# Altium schematic sheet BLE.SchDoc: BLE AC6925A
size A4; SheetNumber: 2; SheetTotal: 3; DOC_NO_SCH_DWG: #0112023010801
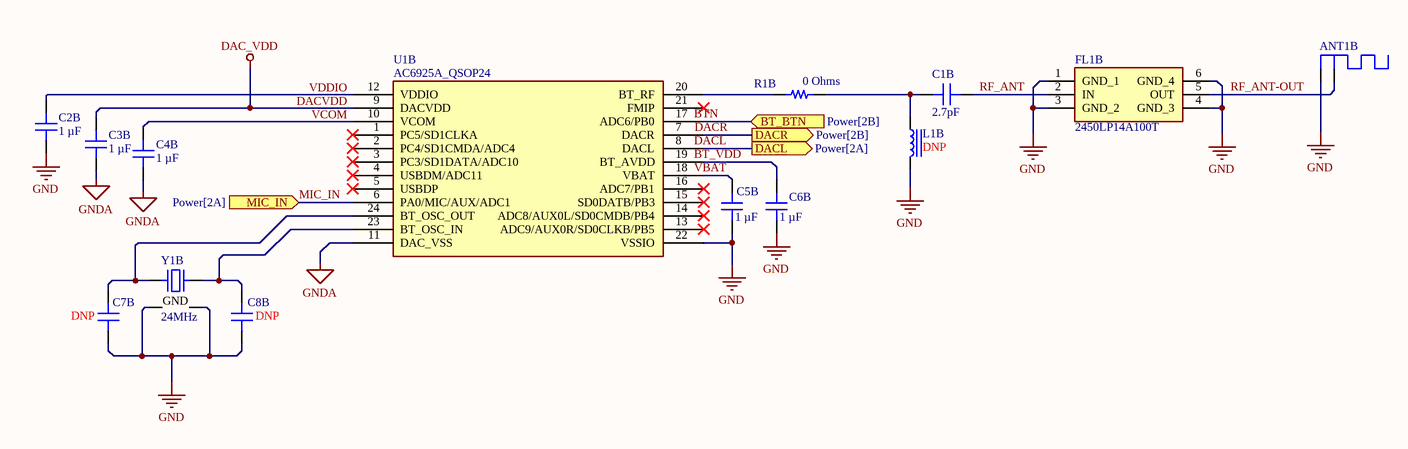
[diagram p0: BLE.SchDoc]

## Parts
ANT1B  ANTENNA  [RN-ANT]  (value not drawn)
C1B  2.7pF  [CAP 0402_1005]
C2B  1 µF  [CAP 0603_1608]
C3B  1 µF  [CAP 0603_1608]
C4B  1 µF  [CAP 0603_1608]
C5B  1 µF  [CAP 0603_1608]
C6B  1 µF  [CAP 0603_1608]
C7B  DNP  [CAP 0402_1005]
C8B  DNP  [CAP 0402_1005]
FL1B  2450LP14A100T  [2450LP14A100T]
L1B  DNP  [IND 0402_1005 RF WW]
R1B  0 Ohms  [RES 0402_1005]
U1B  AC6925A  [AC6925A]  (value not drawn)
Y1B  24MHz  [ABRACON ABM10]

## Ports
BT_BTN (in, see Power[2B]), DACL (out, see Power[2A]), DACR (out, see Power[2B]), MIC_IN (in, see Power[2A])

## Nets
DAC_VDD: C3B.2 U1B.9(DACVDD)
GND: ANT1B.GND C2B.1 C5B.1 C6B.1 C7B.1 C8B.1 FL1B.1(GND_1) FL1B.3(GND_2) FL1B.4(GND_3) FL1B.6(GND_4) L1B.2 U1B.22(VSSIO) Y1B.2(GND) Y1B.4(GND)
GNDA: C3B.1 C4B.1 U1B.11(DAC_VSS)
BT_VDD: C6B.2 U1B.19(BT_AVDD)
BTN: U1B.17(ADC6/PB0) ; port BT_BTN
DACL: U1B.8(DACL) ; port DACL
DACR: U1B.7(DACR) ; port DACR
MIC_IN: U1B.6(PA0/MIC/AUX/ADC1) ; port MIC_IN
RF_ANT: C1B.2 FL1B.2(IN)
RF_ANT-OUT: ANT1B.FEED FL1B.5(OUT)
VBAT: C5B.2 U1B.18(VBAT)
NetC1B_1: C1B.1 L1B.1 R1B.2
NetC2B_2: C2B.2 U1B.12(VDDIO)
NetC4B_2: C4B.2 U1B.10(VCOM)
NetC7B_2: C7B.2 U1B.24(BT_OSC_OUT) Y1B.1
NetC8B_2: C8B.2 U1B.23(BT_OSC_IN) Y1B.3
NetR1B_1: R1B.1 U1B.20(BT_RF)

Not connected (* = marked no-connect by the designer): U1B 1(PC5/SD1CLKA)* 2(PC4/SD1CMDA/ADC4)* 3(PC3/SD1DATA/ADC10)* 4(USBDM/ADC11)* 5(USBDP)* 13(ADC9/AUX0R/SD0CLKB/PB5)* 14(ADC8/AUX0L/SD0CMDB/PB4)* 15(SD0DATB/PB3)* 16(ADC7/PB1)* 21(FMIP)*

## Notes on the sheet
- Labels drawn without touching a wire or pin: DACVDD, VCOM, VDDIO
- THIS DOCUMENT AND THE DATA DISCLOSED HEREIN OR
- HEREWITH IS THE PROPERTY OF SPD Ind.
- ENG:
- DHARAGESWARAN S
- APPROVALS
- DATE
- PROJECT
- DSN:
- CHK:
- REFERENCE DOCUMENTS
- PROJECT REVISION:
- TITLE
- DOCUMENT REVISION:
- Email: sdhamuvkl@gmail.com <https://github.com/DhamuVkl>
- BOM:
- FAB DWG:
- PCB DWG:
- ASSY DWG:
- SCALE:
- A4
- SIZE
- CAGE CODE
- FILE NAME
- DWG NO.
- SHEET
- REV
- OF
- (in symbol AC6925A) AC6925A_QSOP24

## Library data of the parts
ANT1B = ANTENNA: 1.575GHz, 2.45GHz Bluetooth, GPS, Wi-Fi Chip RF Antenna 2.4GHz ~ 2.5GHz 0.28dBi, -2.17dBi, -0.82dBi, 0.24dBi Solder Surface Mount; MF: Infineon Technologies; Package: SMD-2 Infineon Technologies; MP: Antenna; Value: *; Availability: Unavailable; Price: None; SnapEDA_Link: https://www.snapeda.com/parts/Antenna/Infineon%20Technologies/view-part/3603982/?ref=snap
C1B = 04023A2R7BAT2A: CAP CER 2.7PF 25V NP0 0402; Manufacturer: AVX Corporation; id: 1723; Temperature Coefficient: C0G, NP0; Tolerance: ±0.1pF; Part Number: 04023A2R7BAT2A; Value: 2.7pF; Supplier Part Number 1: 478-12612-1-ND; ComponentLink2Description: DigiKey Link; ComponentLink1URL: http://datasheets.avx.com/C0GNP0-Dielectric.pdf; PartId: 7013; Supplier 1: DigiKey; Series: -; LastUpdated: 2022-02-08T12:26:50.017; Part Status: Active; Capacitance: 2.7pF; Device Package: 0402 (1005 Metric); Thickness (Max): 0.022" (0.56mm); Voltage - Rated: 25V; Minimum Order: 1; Packaging: TapeAndReel; Applications: General Purpose; Package / Case: 0402 (1005 Metric); ComponentLink1Description: Datasheet; Price: 0.06; ComponentLink2URL: http://digikey.com/product-detail/en/avx-corporation/04023A2R7BAT2A/478-12612-1-ND/9949150; Lifecycle Status: Active; Operating Temperature: -55°C ~ 125°C; Size / Dimension: 0.039" L x 0.020" W (1.00mm x 0.50mm); Mounting Type: Surface Mount, MLCC
C2B C3B C4B C5B C6B = CC0603ZRY5V6BB105: CAP CER 1UF 10V Y5V 0603; Manufacturer: Yageo; id: 740; Temperature Coefficient: Y5V (F); Tolerance: -20%, +80%; Part Number: CC0603ZRY5V6BB105; Value: 1 µF; Supplier Part Number 1: 311-1357-1-ND; ComponentLink2Description: DigiKey Link; ComponentLink1URL: http://www.yageo.com/documents/recent/UPY-GPHC_Y5V_6.3V-to-50V_8.pdf; PartId: 5197; Supplier 1: DigiKey; Series: CC; LastUpdated: 2023-01-03T20:07:40.253; Part Status: Active; Capacitance: 1 µF; Device Package: 0603 (1608 Metric); Thickness (Max): 0.035" (0.90mm); Voltage - Rated: 10V; Minimum Order: 1; Packaging: TapeAndReel; Applications: General Purpose; Package / Case: 0603 (1608 Metric); ComponentLink1Description: Datasheet; Price: 0.01; ComponentLink2URL: https://www.digikey.com/en/products/detail/yageo/CC0603ZRY5V6BB105/2103095; Lifecycle Status: Active; Operating Temperature: -30°C ~ 85°C; Size / Dimension: 0.063" L x 0.031" W (1.60mm x 0.80mm); Mounting Type: Surface Mount, MLCC
C7B C8B = 885012005007: CAP CER 10PF 10V C0G/NP0 0402; Manufacturer: Würth Elektronik; id: 1924; Temperature Coefficient: C0G, NP0; Tolerance: ±5%; Part Number: 885012005007; Value: 10 pF; Supplier Part Number 1: 732-7425-1-ND; ComponentLink2Description: DigiKey Link; ComponentLink1URL: https://katalog.we-online.de/pbs/datasheet/885012005007.pdf; PartId: 7736; Supplier 1: DigiKey; Series: WCAP-CSGP; LastUpdated: 2023-01-03T20:04:00.900; Part Status: Active; Capacitance: 10 pF; Device Package: 0402 (1005 Metric); Thickness (Max): 0.022" (0.55mm); Voltage - Rated: 10V; Minimum Order: 1; Packaging: TapeAndReel; Applications: General Purpose; Package / Case: 0402 (1005 Metric); ComponentLink1Description: Datasheet; Price: 0.01; ComponentLink2URL: https://www.digikey.com/en/products/detail/würth-elektronik/885012005007/5453280; Lifecycle Status: Active; Operating Temperature: -55°C ~ 125°C; Size / Dimension: 0.039" L x 0.020" W (1.00mm x 0.50mm); Mounting Type: Surface Mount, MLCC
FL1B = 2450LP14A100T: Filter; Manufacturer_Name: JOHANSON TECHNOLOGY; Datasheet Link: https://componentsearchengine.com/Datasheets/1/2450LP14A100T.pdf; Height: 0.7mm; Manufacturer_Part_Number: 2450LP14A100T; Mouser Part Number: 609-2450LP14A100T; Mouser Price/Stock: https://www.mouser.co.uk/ProductDetail/Johanson-Technology/2450LP14A100T?qs=yCnrNFeXz%252BgP94nTCDCKIA%3D%3D; Arrow Part Number: 2450LP14A100T; Arrow Price/Stock: https://www.arrow.com/en/products/2450lp14a100t/johanson-dielectrics?region=nac; Supplier 1: Mouser; Supplier Part Number 1: 609-2450LP14A100T
L1B = 744765010A: FIXED IND 1NH 1.36A 45 MOHM SMD; Manufacturer: Würth Elektronik; id: 685; Frequency - Self Resonant: 6GHz; Tolerance: ±0.2nH; Type: Drum Core, Wirewound; Inductance Frequency - Test: 250 MHz; Q @ Freq: 13 @ 250MHz; Material - Core: Ceramic; DC Resistance (DCR): 45mOhm Max; Shielding: Unshielded; Part Number: 744765010A; Height - Seated (Max): 0.024" (0.60mm); Supplier Part Number 1: 732-1703-1-ND; Current Rating (Amps): 1.36 A; Supplier Device Package: 0402 (1005 Metric); Inductance: 1 nH; ComponentLink1Description: Datasheet; ComponentLink2URL: https://www.digikey.com/en/products/detail/würth-elektronik/744765010A/1994068; ComponentLink1URL: https://katalog.we-online.de/pbs/datasheet/744765010A.pdf; Supplier 1: DigiKey; Series: WE-KI; Part Status: Active; ComponentLink2Description: DigiKey Link; Device Package: 0402 (1005 Metric); Packaging: TapeAndReel; Minimum Order: 1; Package / Case: 0402 (1005 Metric); PartId: 685; Lifecycle Status: Active; LastUpdated: 2023-01-02T20:59:39.830; Operating Temperature: -40°C ~ 125°C; Value: 1 nH; Size / Dimension: 0.039" L x 0.022" W (1.00mm x 0.55mm); Mounting Type: Surface Mount; Price: 0.27
R1B = AC0402JR-070RL: RES SMD 0 OHM JUMPER 1/16W 0402; Manufacturer: Yageo; id: 9339; Power (Watts): 0.063W, 1/16W; Part Number: AC0402JR-070RL; Height - Seated (Max): 0.015" (0.37mm); Supplier Part Number 1: 311-0.0LBCT-ND; Supplier Device Package: 0402; ComponentLink1Description: Datasheet; ComponentLink2URL: https://www.digikey.com/en/products/detail/yageo/AC0402JR-070RL/2827807; Features: Automotive AEC-Q200, Moisture Resistant; ComponentLink1URL: https://www.yageo.com/upload/media/product/productsearch/datasheet/rchip/PYu-AC_51_RoHS_L_7.pdf; Composition: Thick Film; Tolerance: Jumper; Supplier 1: DigiKey; Series: AC; Part Status: Active; ComponentLink2Description: DigiKey Link; Device Package: 0402 (1005 Metric); Packaging: CutTape; Ratings: AEC-Q200; Minimum Order: 1; Package / Case: 0402 (1005 Metric); PartId: 20617; Lifecycle Status: Active; LastUpdated: 2023-01-02T20:20:32.243; Operating Temperature: -55°C ~ 155°C; Number Of Terminations: 2; Value: 0 Ohms; Size / Dimension: 0.039" L x 0.020" W (1.00mm x 0.50mm); Price: 0.01; Resistance: 0 Ohms
U1B = AC6925A: Bluetooth Audio IC; MF: Analog Devices; MP: MAX1092BCEG+; Value: *; Package: QSOP-24 Maxim; Check_prices: https://www.snapeda.com/parts/MAX1092BCEG+/Analog+Devices/view-part/?ref=eda; Price: None; Availability: In Stock; SnapEDA_Link: https://www.snapeda.com/parts/MAX1092BCEG+/Analog+Devices/view-part/?ref=snap
Y1B = ABM10-24.000MHZ-E20-T: CRYSTAL 24.0000MHZ 10PF SMD; Manufacturer: Abracon LLC; id: 280; Frequency Tolerance: ±20ppm; Operating Mode: Fundamental; Esr (Equivalent Series Resistance): 100 Ohms; Part Number: ABM10-24.000MHZ-E20-T; Height - Seated (Max): 0.028" (0.70mm); Supplier Part Number 1: 535-9093-1-ND; ComponentLink1Description: Datasheet; ComponentLink2URL: http://digikey.com/product-detail/en/abracon-llc/ABM10-24.000MHZ-E20-T/535-9093-1-ND/675610; ComponentLink1URL: https://abracon.com/Resonators/ABM10.pdf; Supplier 1: DigiKey; Frequency: 24MHz; Series: ABM10; Part Status: Active; Type: MHz Crystal; ComponentLink2Description: DigiKey Link; Device Package: 4-SMD, No Lead; Packaging: TapeAndReel; Frequency Stability: ±20ppm; Minimum Order: 1; Package / Case: 4-SMD, No Lead; PartId: 280; Lifecycle Status: Active; LastUpdated: 2020-03-19T22:27:45.907; Operating Temperature: -20°C ~ 70°C; Value: 24MHz; Size / Dimension: 0.098" L x 0.079" W (2.50mm x 2.00mm); Mounting Type: Surface Mount; Price: 0.96; Load Capacitance: 10pF